# Altium schematic sheet Project Diagram.SchDoc
size A; SheetNumber: 1; SheetTotal: 4
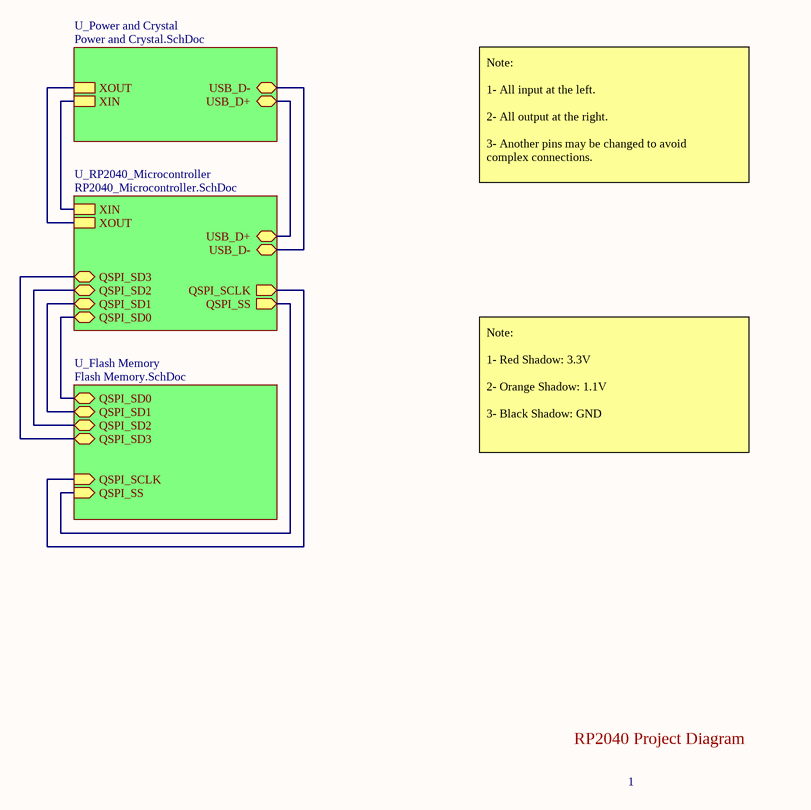
[diagram p0: Project Diagram.SchDoc]

## Sub-sheets
U_Flash Memory = Flash Memory.SchDoc: QSPI_SD0 (bidir), QSPI_SD1 (bidir), QSPI_SD2 (bidir), QSPI_SD3 (bidir), QSPI_SCLK (in), QSPI_SS (in)
U_Power and Crystal = Power and Crystal.SchDoc: XIN, XOUT, USB_D+ (bidir), USB_D- (bidir)
U_RP2040_Microcontroller = RP2040_Microcontroller.SchDoc: USB_D+ (bidir), USB_D- (bidir), QSPI_SS (out), QSPI_SD0 (bidir), QSPI_SD1 (bidir), QSPI_SD2 (bidir), QSPI_SD3 (bidir), QSPI_SCLK (out), XIN, XOUT

## Nets
(unnamed): sheet U_RP2040_Microcontroller/USB_D+, sheet U_Power and Crystal/USB_D+
(unnamed): sheet U_RP2040_Microcontroller/USB_D-, sheet U_Power and Crystal/USB_D-
(unnamed): sheet U_RP2040_Microcontroller/QSPI_SS, sheet U_Flash Memory/QSPI_SS
(unnamed): sheet U_RP2040_Microcontroller/QSPI_SD0, sheet U_Flash Memory/QSPI_SD0
(unnamed): sheet U_RP2040_Microcontroller/QSPI_SD1, sheet U_Flash Memory/QSPI_SD1
(unnamed): sheet U_RP2040_Microcontroller/QSPI_SD2, sheet U_Flash Memory/QSPI_SD2
(unnamed): sheet U_RP2040_Microcontroller/QSPI_SD3, sheet U_Flash Memory/QSPI_SD3
(unnamed): sheet U_RP2040_Microcontroller/QSPI_SCLK, sheet U_Flash Memory/QSPI_SCLK
(unnamed): sheet U_RP2040_Microcontroller/XIN, sheet U_Power and Crystal/XIN
(unnamed): sheet U_RP2040_Microcontroller/XOUT, sheet U_Power and Crystal/XOUT

## Notes on the sheet
- Note:
  1- All input at the left.
  2- All output at the right.
  3- Another pins may be changed to avoid     complex connections.
- Note:
  1- Red Shadow: 3.3V
  2- Orange Shadow: 1.1V
  3- Black Shadow: GND
- RP2040 Project Diagram
- 1